# EAGLE design 04_ALU (EAGLE 7.5.0)
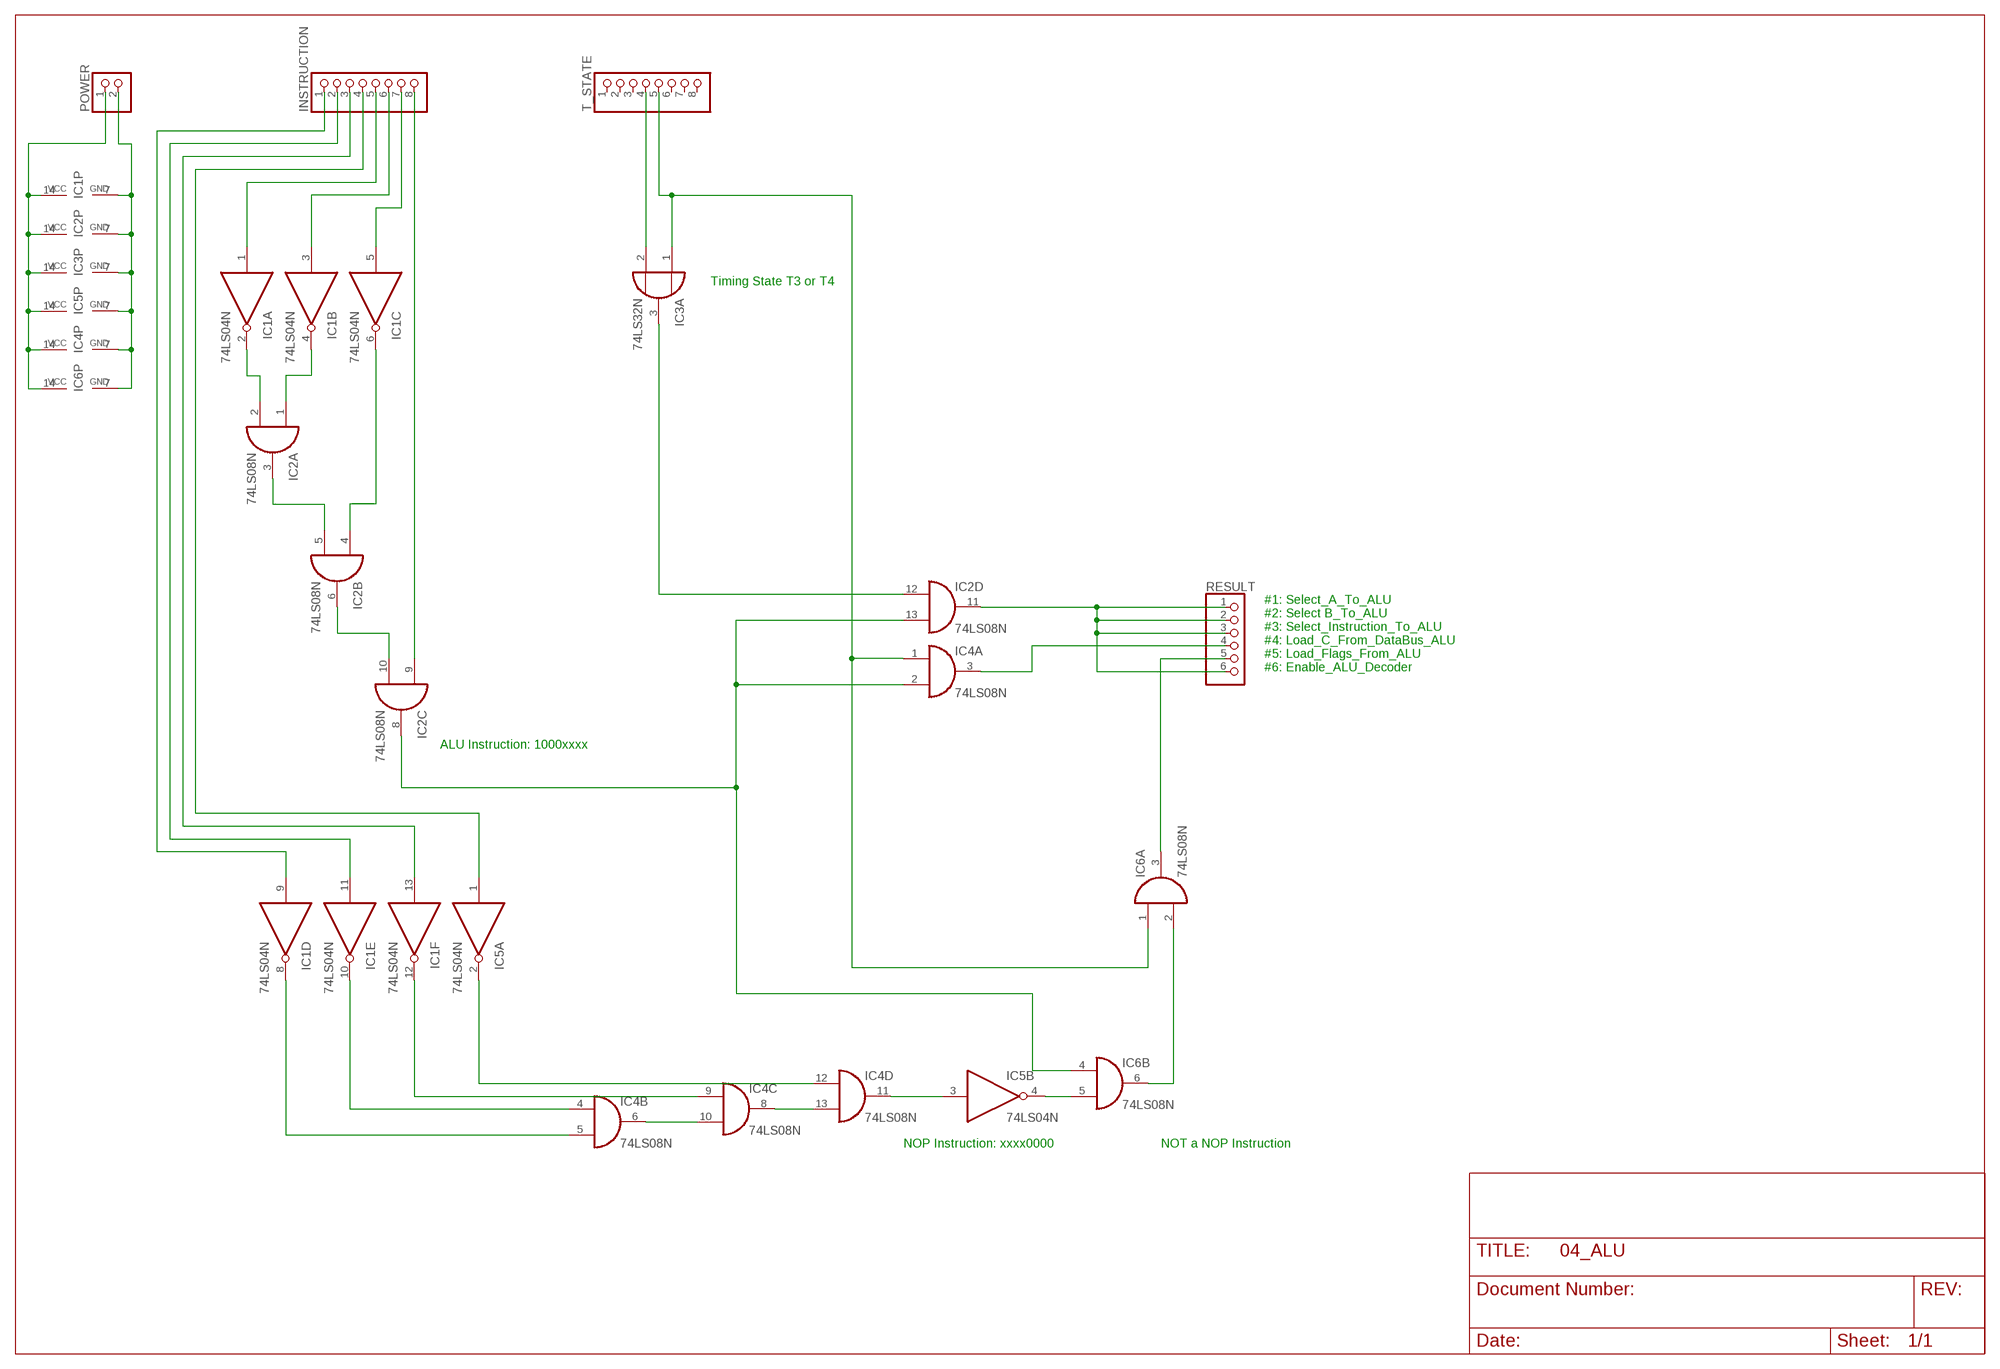
[diagram p0: schematic, sheet 1]

## Parts
IC1  74LS04N  [DIL14]
IC2  74LS08N  [DIL14]
IC3  74LS32N  [DIL14]
IC4  74LS08N  [DIL14]
IC5  74LS04N  [DIL14]
IC6  74LS08N  [DIL14]
INSTRUCTION  PINHD-1X8  [1X08]
POWER  PINHD-1X2  [1X02]
RESULT  PINHD-1X6  [1X06]
T_STATE  PINHD-1X8  [1X08]

## Nets
GND: IC1.7(P:GND) IC2.7(P:GND) IC3.7(P:GND) IC4.7(P:GND) IC5.7(P:GND) IC6.7(P:GND) POWER.2
N$1: IC1.1(A:I) INSTRUCTION.5
N$2: IC1.3(B:I) INSTRUCTION.6
N$3: IC1.5(C:I) INSTRUCTION.7
N$4: IC1.2(A:O) IC2.2(A:I1)
N$5: IC1.4(B:O) IC2.1(A:I0)
N$6: IC2.3(A:O) IC2.5(B:I1)
N$7: IC1.6(C:O) IC2.4(B:I0)
N$8: IC2.9(C:I0) INSTRUCTION.8
N$9: IC2.6(B:O) IC2.10(C:I1)
N$10: IC3.2(A:I1) T_STATE.4
N$11: IC3.1(A:I0) IC4.1(A:I0) IC6.1(A:I0) T_STATE.5
N$12: IC2.8(C:O) IC2.13(D:I1) IC4.2(A:I1) IC6.4(B:I0)
N$13: IC2.12(D:I0) IC3.3(A:O)
N$14: IC2.11(D:O) RESULT.1 RESULT.2 RESULT.3 RESULT.6
N$15: IC4.3(A:O) RESULT.4
N$16: IC1.9(D:I) INSTRUCTION.1
N$17: IC1.11(E:I) INSTRUCTION.2
N$18: IC1.13(F:I) INSTRUCTION.3
N$19: IC5.1(A:I) INSTRUCTION.4
N$20: IC1.8(D:O) IC4.5(B:I1)
N$21: IC1.10(E:O) IC4.4(B:I0)
N$22: IC4.6(B:O) IC4.10(C:I1)
N$23: IC1.12(F:O) IC4.9(C:I0)
N$24: IC4.8(C:O) IC4.13(D:I1)
N$25: IC4.12(D:I0) IC5.2(A:O)
N$26: IC4.11(D:O) IC5.3(B:I)
N$27: IC5.4(B:O) IC6.5(B:I1)
N$29: IC6.3(A:O) RESULT.5
N$30: IC6.2(A:I1) IC6.6(B:O)
VCC: IC1.14(P:VCC) IC2.14(P:VCC) IC3.14(P:VCC) IC4.14(P:VCC) IC5.14(P:VCC) IC6.14(P:VCC) POWER.1
Unconnected: IC3.4(B:I0) IC3.5(B:I1) IC3.6(B:O) IC3.8(C:O) IC3.9(C:I0) IC3.10(C:I1) IC3.11(D:O) IC3.12(D:I0) IC3.13(D:I1) IC5.5(C:I) IC5.6(C:O) IC5.8(D:O) IC5.9(D:I) IC5.10(E:O) IC5.11(E:I) IC5.12(F:O) IC5.13(F:I) IC6.8(C:O) IC6.9(C:I0) IC6.10(C:I1) IC6.11(D:O) IC6.12(D:I0) IC6.13(D:I1) T_STATE.1 T_STATE.2 T_STATE.3 T_STATE.6 T_STATE.7 T_STATE.8

## Notes on the sheet
- Timing State T3 or T4
- #1: Select_A_To_ALU
  #2: Select B_To_ALU
  #3: Select_Instruction_To_ALU
  #4: Load_C_From_DataBus_ALU
  #5: Load_Flags_From_ALU
  #6: Enable_ALU_Decoder
- ALU Instruction: 1000xxxx
- NOP Instruction: xxxx0000 | NOT a NOP Instruction

## Library data of the parts
IC1 IC5 = 74xx-eu:74*04: Hex INVERTER
IC2 IC4 IC6 = 74xx-eu:74*08: Quad 2-input AND gate
IC3 = 74xx-eu:74*32: Quad 2-input OR gate
INSTRUCTION T_STATE = pinhead:PINHD-1X8: PIN HEADER
POWER = pinhead:PINHD-1X2: PIN HEADER
RESULT = pinhead:PINHD-1X6: PIN HEADER

## Board
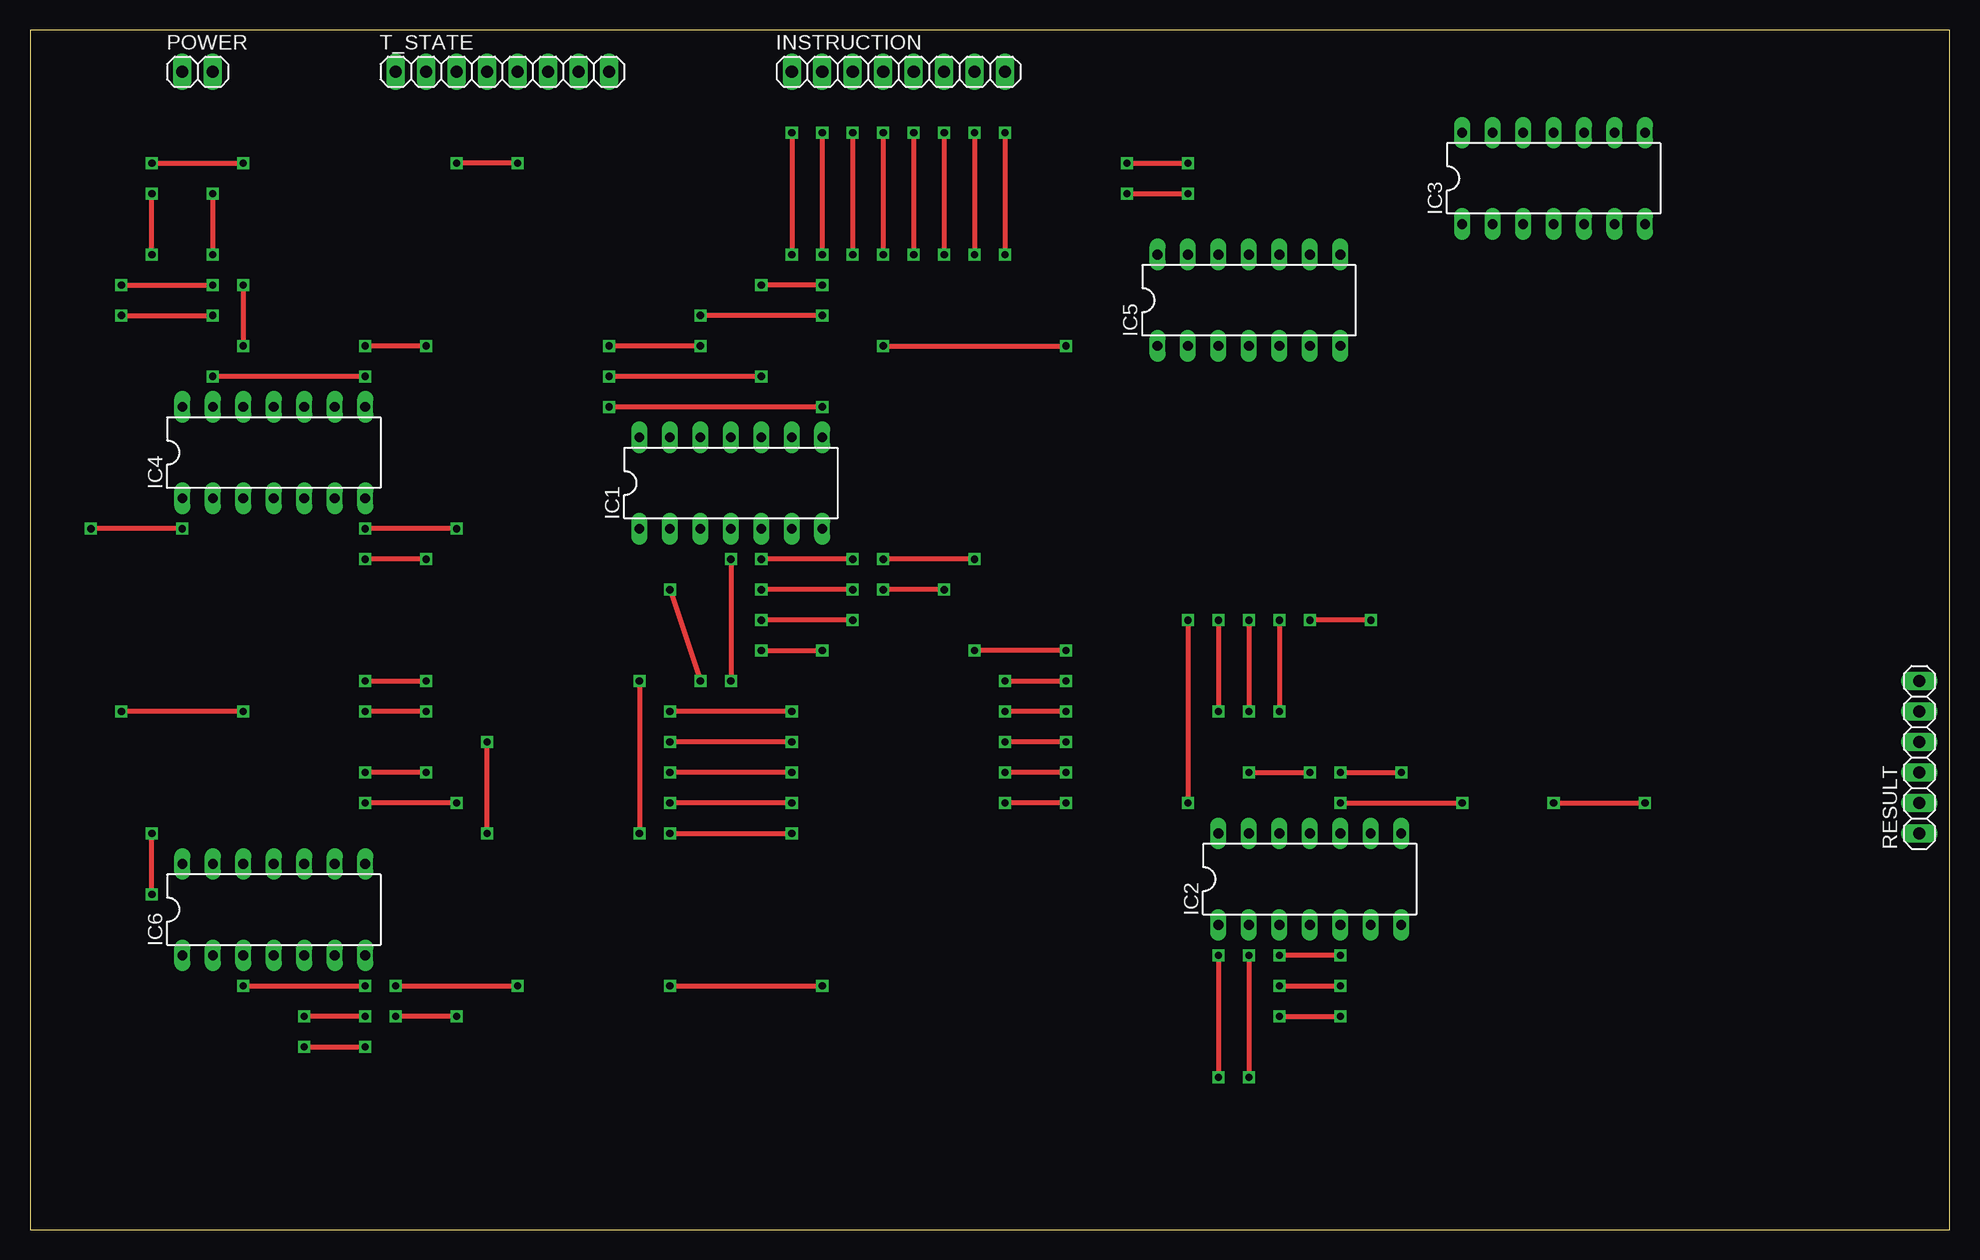
[diagram p1: board, top side]
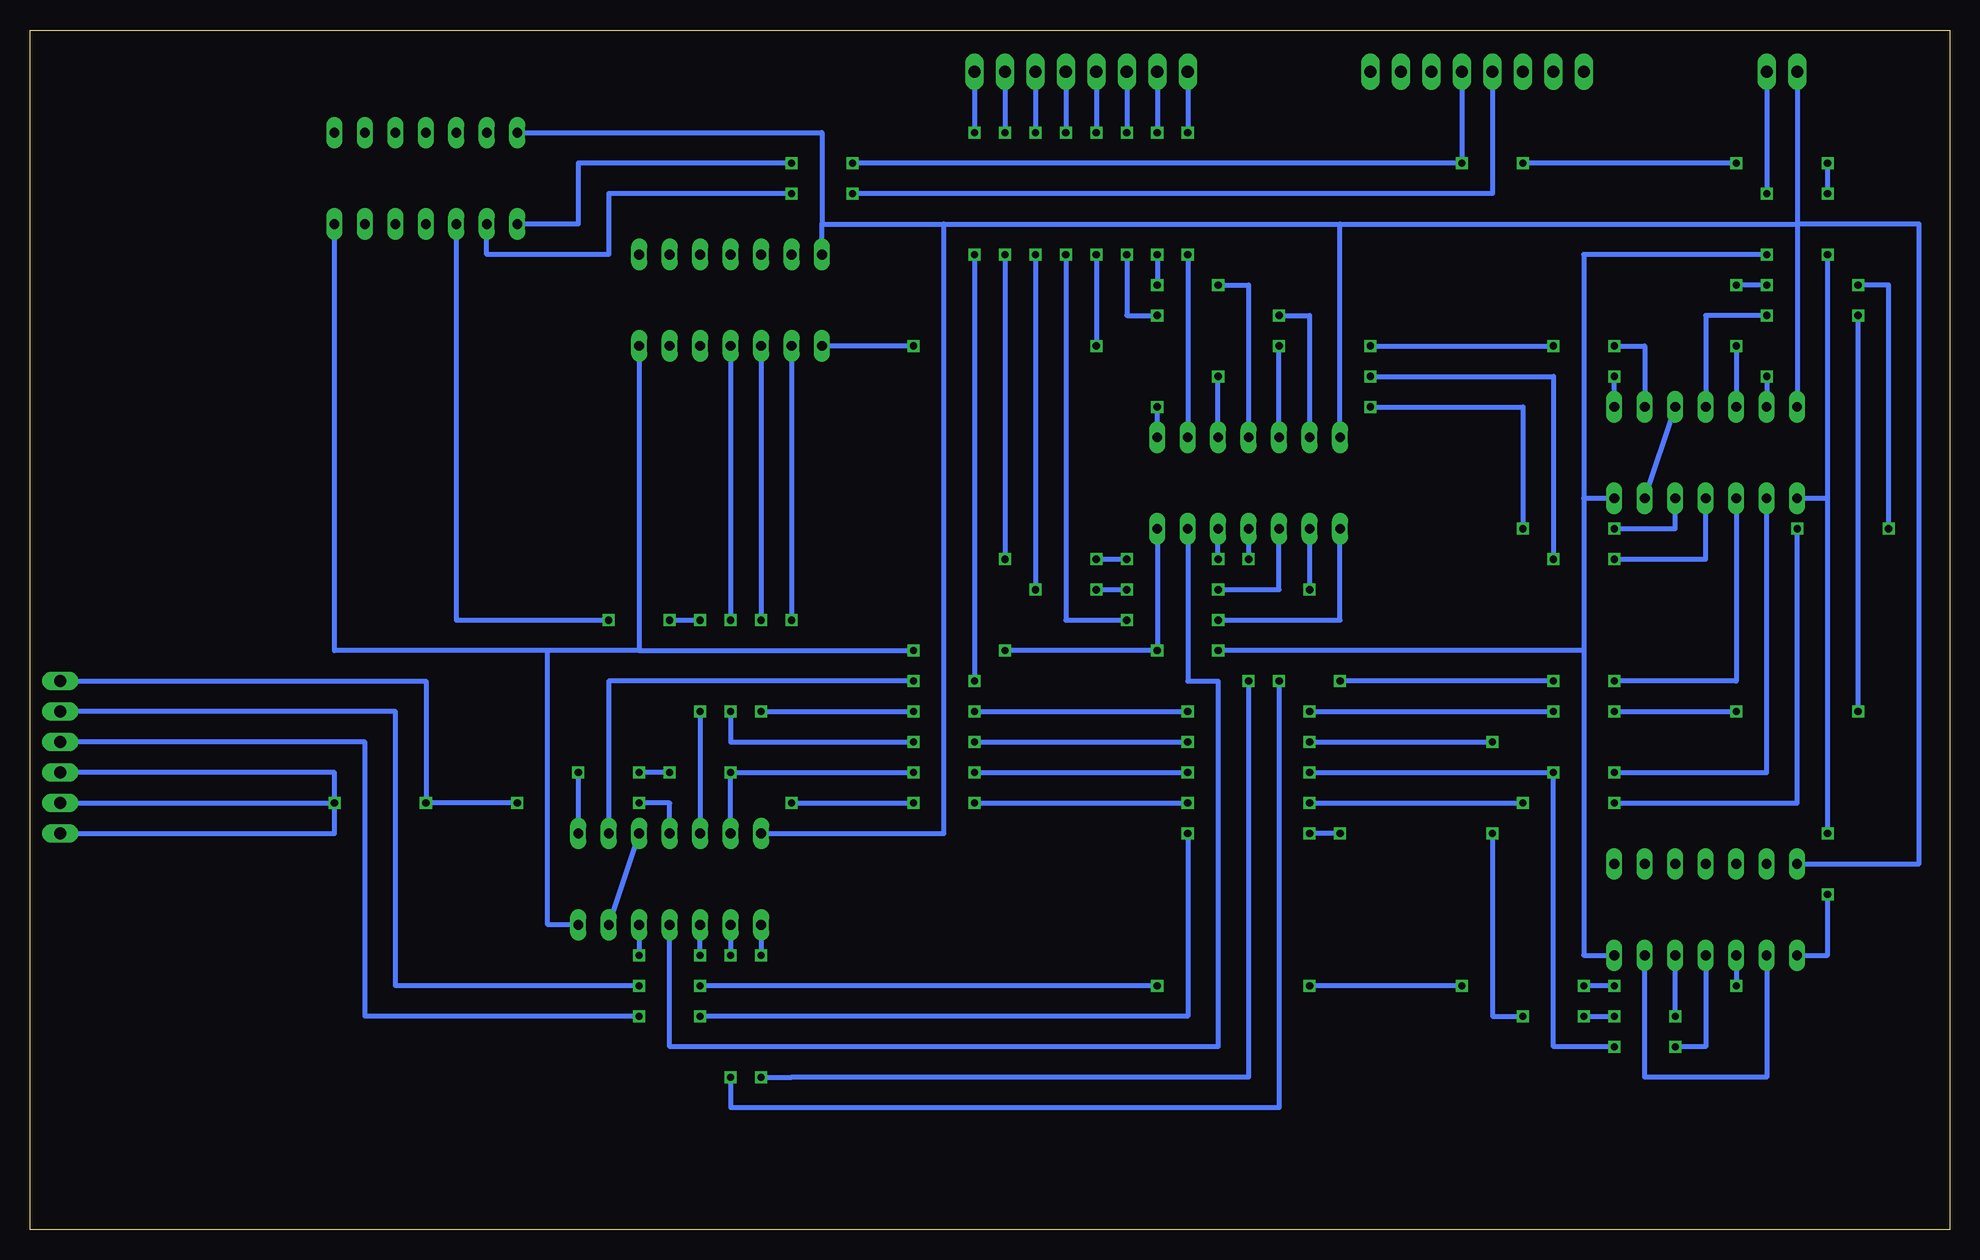
[diagram p2: board, bottom side, seen from below]

Size 160 x 100 mm. Coordinates in mm from the lower left corner, seen from the top.
Outline: 0,0 160,0 160,100 0,100 0,0
Copper layers (1*16): Top 0.035mm / dielectric 1.5mm / Bottom 0.035mm
Design rules "default": minimum track width 10mil, minimum drill 24mil, track to track 8mil, track to pad 8mil, pad to pad 8mil, via to via 8mil, smd to smd 8mil, copper to edge 40mil, drill to drill 8mil, minimum pad ring 10mil, minimum via ring 8mil, stop-mask expansion 4mil, vias tented up to drill 0mil, thermal gap 10mil

### Footprints (pad centres in the part's own frame; a part is rotated, then mirrored left to right if it is on the bottom)
DIL14 = drill 0.813 long: 1 -7.62,-3.81; 2 -5.08,-3.81; 3 -2.54,-3.81; 4 0,-3.81; 5 2.54,-3.81; 6 5.08,-3.81; 7 7.62,-3.81; 8 7.62,3.81; 9 5.08,3.81; 10 2.54,3.81; 11 0,3.81; 12 -2.54,3.81; 13 -5.08,3.81; 14 -7.62,3.81
1X08 = drill 1.016 long: 1 -8.89,0; 2 -6.35,0; 3 -3.81,0; 4 -1.27,0; 5 1.27,0; 6 3.81,0; 7 6.35,0; 8 8.89,0
1X02 = drill 1.016 long: 1 -1.27,0; 2 1.27,0
1X06 = drill 1.016 long: 1 -6.35,0; 2 -3.81,0; 3 -1.27,0; 4 1.27,0; 5 3.81,0; 6 6.35,0

### Placement (x,y rotation side)
IC1  58.42,62.23 0 top
IC2  106.68,29.21 0 top
IC3  127,87.63 0 top
IC4  20.32,64.77 0 top
IC5  101.6,77.47 0 top
IC6  20.32,26.67 0 top
INSTRUCTION  72.39,96.52 0 top
POWER  13.97,96.52 0 top
RESULT  157.48,39.37 90 top
T_STATE  39.37,96.52 0 top

### Tracks (layer width: path | path; a pad name or v marks a point on that pad's centre or on a via)
GND  (via drill 0.6)
  Top 0.406: v15.24,86.36 v15.24,81.28 | v86.36,48.26 v78.74,48.26 | v60.96,48.26 v66.04,48.26
  Bottom 0.406: POWER.2 v15.24,86.36 | v15.24,81.28 30.48,81.28 30.48,60.96 | 30.48,60.96 IC4.7 | 30.48,60.96 30.48,48.26 | 30.48,48.26 30.48,22.86 IC6.7 | IC1.7 v66.04,48.26 v78.74,48.26 | IC5.7 109.22,48.26 | 109.22,48.26 v86.36,48.26 | 109.22,48.26 116.84,48.26 | 116.84,48.26 134.62,48.26 IC3.7 | IC2.7 116.84,25.4 116.84,48.26 | 30.48,48.26 v60.96,48.26
N$1  (via drill 0.6)
  Top 0.406: v73.66,91.44 v73.66,81.28 | v68.58,50.8 v60.96,50.8
  Bottom 0.406: INSTRUCTION.5 v73.66,91.44 | v73.66,81.28 73.66,50.8 v68.58,50.8 | v60.96,50.8 50.8,50.8 IC1.1
N$2  (via drill 0.6)
  Top 0.406: v76.2,91.44 v76.2,81.28 | v76.2,53.34 v71.12,53.34 | v68.58,53.34 v60.96,53.34
  Bottom 0.406: INSTRUCTION.6 v76.2,91.44 | v76.2,81.28 v76.2,53.34 | v71.12,53.34 v68.58,53.34 | v60.96,53.34 55.88,53.34 IC1.3
N$3  (via drill 0.6)
  Top 0.406: v78.74,91.44 v78.74,81.28 | v78.74,55.88 v71.12,55.88 | v68.58,55.88 v60.96,55.88
  Bottom 0.406: INSTRUCTION.7 v78.74,91.44 | v78.74,81.28 v78.74,55.88 | v71.12,55.88 v68.58,55.88 | v60.96,55.88 IC1.5
N$4  (via drill 0.6)
  Top 0.406: v53.34,53.34 v55.88,45.72 | v101.6,22.86 v101.6,12.7
  Bottom 0.406: IC1.2 v53.34,53.34 | v55.88,45.72 55.88,10.16 101.6,10.16 v101.6,12.7 | IC2.2 v101.6,22.86
N$5  (via drill 0.6)
  Top 0.406: v58.42,55.88 v58.42,45.72 | v99.06,22.86 v99.06,12.7
  Bottom 0.406: IC1.4 v58.42,55.88 | v58.42,45.72 58.42,12.7 96.52,12.7 v99.06,12.7 | IC2.1 v99.06,22.86
N$6  (via drill 0.6)
  Top 0.406: v109.22,22.86 v104.14,22.86
  Bottom 0.406: IC2.5 v109.22,22.86 | v104.14,22.86 IC2.3
N$7
  Bottom 0.406: IC1.6 63.5,45.72 60.96,45.72 60.96,15.24 106.68,15.24 IC2.4
N$8  (via drill 0.6)
  Top 0.406: v81.28,91.44 v81.28,81.28 | v81.28,45.72 v86.36,45.72
  Bottom 0.406: INSTRUCTION.8 v81.28,91.44 | v81.28,81.28 v81.28,45.72 | IC2.9 111.76,45.72 v86.36,45.72
N$9
  Bottom 0.406: IC2.10 IC2.6
N$10  (via drill 0.6)
  Top 0.406: v91.44,86.36 v96.52,86.36
  Bottom 0.406: T_STATE.4 38.1,86.36 v91.44,86.36 | v96.52,86.36 111.76,86.36 111.76,81.28 121.92,81.28 IC3.2
N$11  (via drill 0.6)
  Top 0.406: v91.44,88.9 v96.52,88.9 | v10.16,81.28 v10.16,86.36 | v10.16,88.9 v17.78,88.9 | v40.64,88.9 v35.56,88.9 | v10.16,27.94 v10.16,33.02
  Bottom 0.406: T_STATE.5 v40.64,88.9 v91.44,88.9 | v96.52,88.9 114.3,88.9 114.3,83.82 IC3.1 | IC4.1 10.16,60.96 | 10.16,60.96 v10.16,81.28 | v10.16,86.36 v10.16,88.9 | v17.78,88.9 v35.56,88.9 | IC6.1 10.16,22.86 v10.16,27.94 | v10.16,33.02 10.16,60.96
N$12  (via drill 0.6)
  Top 0.406: v101.6,38.1 v106.68,38.1 | v109.22,38.1 v114.3,38.1 | v86.36,38.1 v81.28,38.1 | v63.5,38.1 v53.34,38.1 | v33.02,38.1 v27.94,38.1 | v22.86,15.24 v27.94,15.24
  Bottom 0.406: v106.68,38.1 v109.22,38.1 | v114.3,38.1 IC2.8 | IC2.13 v101.6,38.1 v86.36,38.1 | v81.28,38.1 v63.5,38.1 | v53.34,38.1 v33.02,38.1 33.02,15.24 v27.94,15.24 | v27.94,38.1 15.24,38.1 IC4.2 | IC6.4 20.32,15.24 v22.86,15.24
N$13  (via drill 0.6)
  Top 0.406: v111.76,50.8 v106.68,50.8 | v104.14,50.8 v104.14,43.18
  Bottom 0.406: IC3.3 124.46,50.8 v111.76,50.8 | v106.68,50.8 v104.14,50.8 | v104.14,43.18 IC2.12
N$14  (via drill 0.6)
  Top 0.406: v109.22,35.56 v119.38,35.56 | v127,35.56 v134.62,35.56
  Bottom 0.406: IC2.11 106.68,35.56 v109.22,35.56 | v119.38,35.56 v127,35.56 127,45.72 RESULT.6 | v134.62,35.56 134.62,38.1 RESULT.3 | RESULT.2 v134.62,35.56 | RESULT.1 134.62,33.02 v134.62,35.56
N$15  (via drill 0.6)
  Top 0.406: v27.94,45.72 v33.02,45.72 | v50.8,45.72 v50.8,33.02 | v53.34,33.02 v63.5,33.02 | v104.14,17.78 v109.22,17.78
  Bottom 0.406: IC4.3 17.78,45.72 v27.94,45.72 | v33.02,45.72 v50.8,45.72 | v50.8,33.02 v53.34,33.02 | v63.5,33.02 63.5,17.78 v104.14,17.78 | v109.22,17.78 132.08,17.78 132.08,40.64 RESULT.4
N$16  (via drill 0.6)
  Top 0.406: v63.5,91.44 v63.5,81.28
  Bottom 0.406: INSTRUCTION.1 v63.5,91.44 | v63.5,81.28 IC1.9
N$17  (via drill 0.6)
  Top 0.406: v66.04,91.44 v66.04,81.28 | v66.04,78.74 v60.96,78.74
  Bottom 0.406: INSTRUCTION.2 v66.04,91.44 | v66.04,81.28 v66.04,78.74 | v60.96,78.74 58.42,78.74 IC1.11
N$18  (via drill 0.6)
  Top 0.406: v68.58,91.44 v68.58,81.28 | v66.04,76.2 v55.88,76.2
  Bottom 0.406: INSTRUCTION.3 v68.58,91.44 | v68.58,81.28 68.58,76.2 v66.04,76.2 | v55.88,76.2 53.34,76.2 IC1.13
N$19  (via drill 0.6)
  Top 0.406: v71.12,91.44 v71.12,81.28 | v71.12,73.66 v86.36,73.66
  Bottom 0.406: INSTRUCTION.4 v71.12,91.44 | v71.12,81.28 v71.12,73.66 | v86.36,73.66 IC5.1
N$20  (via drill 0.6)
  Top 0.406: v66.04,68.58 v48.26,68.58 | v35.56,58.42 v27.94,58.42
  Bottom 0.406: IC1.8 v66.04,68.58 | v48.26,68.58 35.56,68.58 v35.56,58.42 | v27.94,58.42 22.86,58.42 IC4.5
N$21  (via drill 0.6)
  Top 0.406: v60.96,71.12 v48.26,71.12 | v33.02,55.88 v27.94,55.88
  Bottom 0.406: IC1.10 v60.96,71.12 | v48.26,71.12 33.02,71.12 v33.02,55.88 | v27.94,55.88 20.32,55.88 IC4.4
N$22
  Bottom 0.406: IC4.6 IC4.10
N$23  (via drill 0.6)
  Top 0.406: v55.88,73.66 v48.26,73.66 | v33.02,73.66 v27.94,73.66
  Bottom 0.406: IC1.12 v55.88,73.66 | v48.26,73.66 v33.02,73.66 | v27.94,73.66 25.4,73.66 IC4.9
N$24  (via drill 0.6)
  Top 0.406: v27.94,71.12 v15.24,71.12
  Bottom 0.406: IC4.8 v27.94,71.12 | v15.24,71.12 IC4.13
N$25  (via drill 0.6)
  Top 0.406: v96.52,50.8 v96.52,35.56 | v86.36,35.56 v81.28,35.56 | v63.5,35.56 v53.34,35.56 | v35.56,35.56 v27.94,35.56 | v12.7,58.42 v5.08,58.42 | v7.62,78.74 v15.24,78.74 | v17.78,78.74 v17.78,73.66
  Bottom 0.406: IC5.2 v96.52,50.8 | v96.52,35.56 v86.36,35.56 | v81.28,35.56 v63.5,35.56 | v53.34,35.56 v35.56,35.56 | v27.94,35.56 12.7,35.56 v12.7,58.42 | v5.08,58.42 5.08,78.74 v7.62,78.74 | v15.24,78.74 v17.78,78.74 | v17.78,73.66 IC4.12
N$26  (via drill 0.6)
  Top 0.406: v99.06,50.8 v99.06,43.18 | v86.36,43.18 v81.28,43.18 | v63.5,43.18 v53.34,43.18 | v33.02,43.18 v27.94,43.18 | v17.78,43.18 v7.62,43.18 | v7.62,76.2 v15.24,76.2
  Bottom 0.406: IC5.3 v99.06,50.8 | v99.06,43.18 v86.36,43.18 | v81.28,43.18 v63.5,43.18 | v53.34,43.18 v33.02,43.18 | v27.94,43.18 v17.78,43.18 | v7.62,43.18 v7.62,76.2 | v15.24,76.2 20.32,76.2 IC4.11
N$27  (via drill 0.6)
  Top 0.406: v101.6,50.8 v101.6,43.18 | v86.36,40.64 v81.28,40.64 | v63.5,40.64 v53.34,40.64 | v35.56,17.78 v30.48,17.78 | v27.94,17.78 v22.86,17.78 | v38.1,33.02 v38.1,40.64
  Bottom 0.406: IC5.4 v101.6,50.8 | v101.6,43.18 101.6,40.64 v86.36,40.64 | v81.28,40.64 v63.5,40.64 | v53.34,40.64 v38.1,40.64 | v30.48,17.78 v27.94,17.78 | v22.86,17.78 IC6.5 | v38.1,33.02 38.1,17.78 v35.56,17.78
N$29  (via drill 0.6)
  Top 0.406: v17.78,20.32 v27.94,20.32 | v30.48,20.32 v40.64,20.32 | v53.34,20.32 v66.04,20.32 | v104.14,20.32 v109.22,20.32
  Bottom 0.406: IC6.3 v17.78,20.32 | v27.94,20.32 v30.48,20.32 | v40.64,20.32 v53.34,20.32 | v66.04,20.32 v104.14,20.32 | v109.22,20.32 129.54,20.32 129.54,43.18 RESULT.5
N$30
  Bottom 0.406: IC6.2 15.24,12.7 25.4,12.7 IC6.6
VCC
  Bottom 0.406: POWER.1 12.7,83.82 | 12.7,83.82 2.54,83.82 2.54,30.48 IC6.14 | IC1.14 50.8,83.82 | 50.8,83.82 12.7,83.82 | IC5.14 93.98,83.82 | 93.98,83.82 83.82,83.82 | 83.82,83.82 50.8,83.82 | IC3.14 93.98,91.44 93.98,83.82 | IC2.14 83.82,33.02 83.82,83.82 | 12.7,83.82 IC4.14